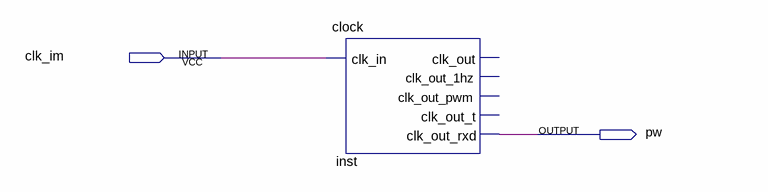
[diagram p0: schematic sheet]
// Quartus schematic dc_test.bdf as structural Verilog: 1 symbols, 2 pins
module dc_test (
  input  clk_im,
  output pw
);

  clock inst (.clk_in(clk_im), .clk_out_rxd(pw));  // open: clk_out, clk_out_1hz, clk_out_pwm, clk_out_t
endmodule
